# Altium schematic sheet [12] - DOC REVISION HISTORY.SchDoc
size A2; DocumentNumber: 12; SheetNumber: 12; SheetTotal: 13; NameAuthor: Angle Vu
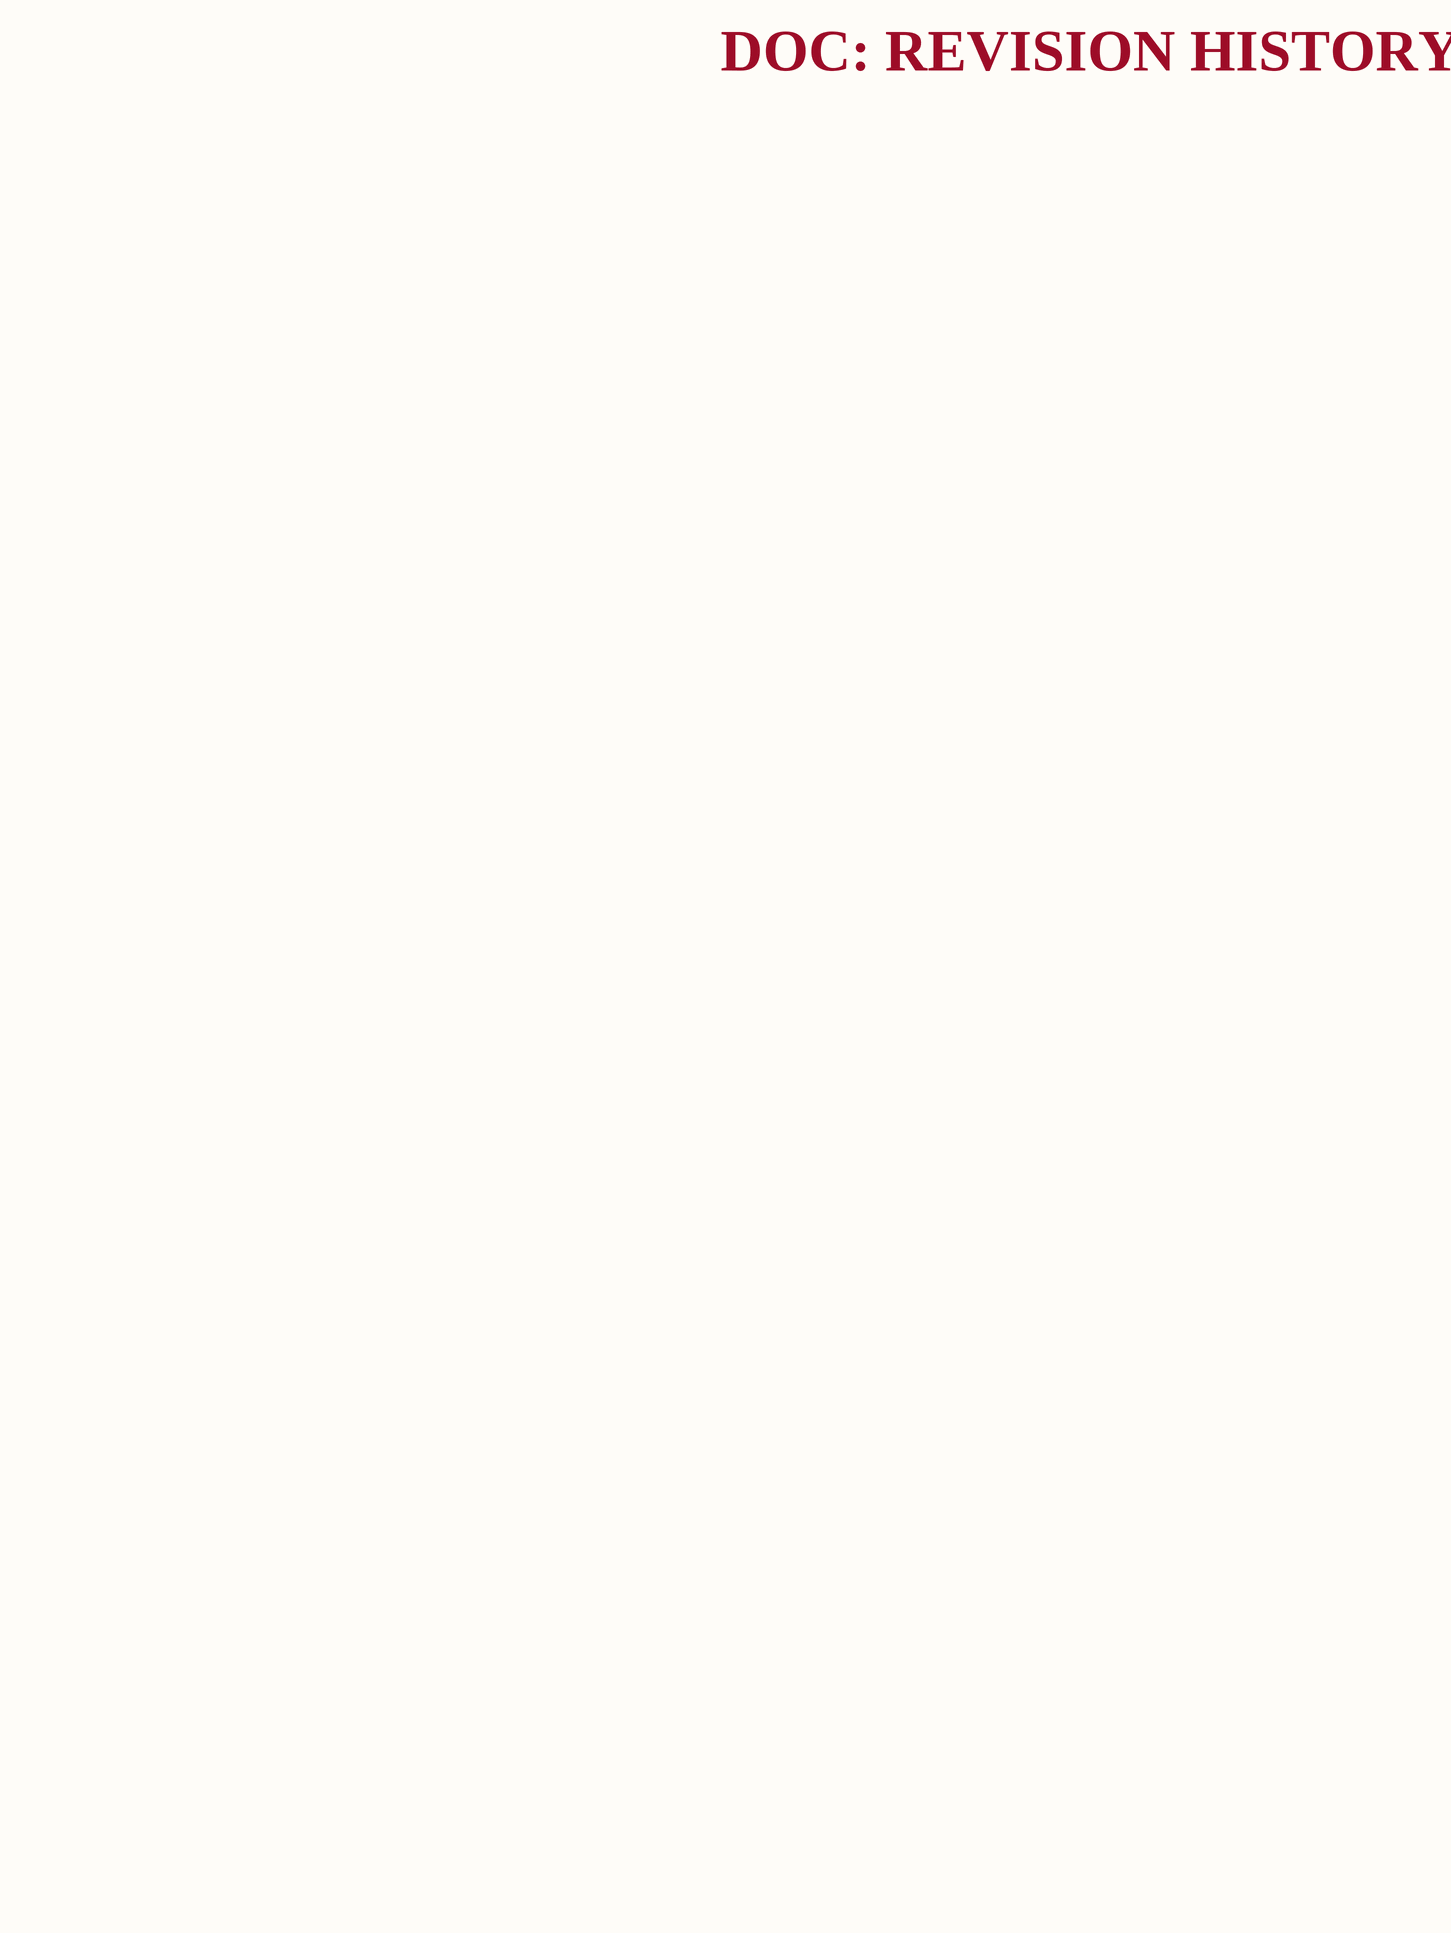
[diagram p0: [12] - DOC REVISION HISTORY.SchDoc]

## Notes on the sheet
- DOC: REVISION HISTORY
- CLOCKS (CPU & PCIE)
- Designed By
- Checked By
- Page Name:
- Size:
- A2
- Company:
- Address:
- Sheet:
- /